# EAGLE schematic Receiver (EAGLE 5.00)
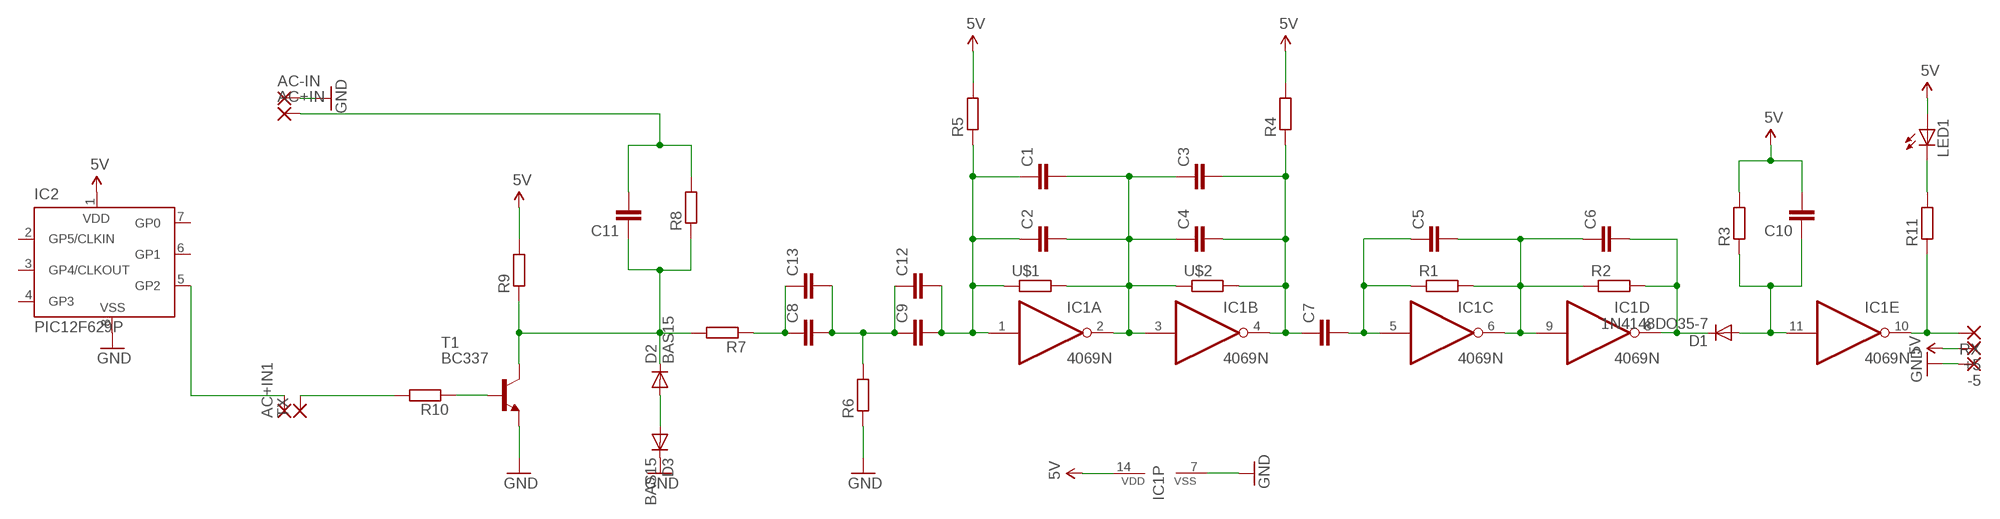
[diagram p0: schematic, sheet 1]

## Parts
+5  2,15/1,0  [2,15/1,0]
-5  2,15/1,0  [2,15/1,0]
AC+IN  2,15/1,0  [2,15/1,0]
AC+IN1  2,15/1,0  [2,15/1,0]
AC-IN  2,15/1,0  [2,15/1,0]
C1  C2.5/2  [C2.5-2]
C2  C2.5/2  [C2.5-2]
C3  C2.5/2  [C2.5-2]
C4  C2.5/2  [C2.5-2]
C5  C2.5/2  [C2.5-2]
C6  C5/2.5  [C5B2.5]
C7  C2.5/2  [C2.5-2]
C8  C5/3  [C5B3]
C9  C5/3  [C5B3]
C10  C2.5/2  [C2.5-2]
C11  C10/5  [C10B5]
C12  C5/3  [C5B3]
C13  C5/3  [C5B3]
D1  1N4148DO35-7  [DO35-7]
D2  BAS15  [DO34-7]
D3  BAS15  [DO34-7]
IC1  4069N  [DIL14]
IC2  PIC12F629P  [DIL8]
LED1  LED5MM  [LED5MM]
R1  R-EU_0207/2V  [0207/2V]
R2  R-EU_0204/5  [0204/5]
R3  R-EU_0207/2V  [0207/2V]
R4  R-EU_0207/2V  [0207/2V]
R5  R-EU_0204/7  [0204/7]
R6  R-EU_0207/2V  [0207/2V]
R7  R-EU_0207/2V  [0207/2V]
R8  R-EU_0204/7  [0204/7]
R9  R-EU_0204/7  [0204/7]
R10  R-EU_0204/7  [0204/7]
R11  R-EU_0204/7  [0204/7]
RX  2,15/1,0  [2,15/1,0]
T1  BC337  [TO92]
TX  2,15/1,0  [2,15/1,0]
U$1  R-EU_0204/5  [0204/5]
U$2  R-EU_0207/2V  [0207/2V]

## Nets
5V: +5.1(P) C10.2 IC1.14(P:VDD) IC2.1(VDD) LED1.A R3.2 R4.2 R5.2 R9.2
GND: -5.1(P) AC-IN.1(P) D3.C IC1.7(P:VSS) IC2.8(VSS) R6.1 T1.1(E)
N$1: C5.2 C6.1 IC1.6(C:O) IC1.9(D:I) R1.2 R2.1
N$2: C1.2 C2.2 C3.1 C4.1 IC1.2(A:O) IC1.3(B:I) U$1.2 U$2.1
N$3: C3.2 C4.2 C7.1 IC1.4(B:O) R4.1 U$2.2
N$4: C1.1 C2.1 C9.2 C12.2 IC1.1(A:I) R5.1 U$1.1
N$5: C5.1 C7.2 IC1.5(C:I) R1.1
N$6: C8.2 C9.1 C12.1 C13.2 R6.2
N$7: C6.2 D1.C IC1.8(D:O) R2.2
N$8: C10.1 D1.A IC1.11(E:I) R3.1
N$9: C8.1 C13.1 R7.1
N$10: R10.1 T1.2(B)
N$11: D2.A D3.A
N$12: AC+IN.1(P) C11.2 R8.2
N$13: IC1.10(E:O) R11.1 RX.1(P)
N$14: C11.1 D2.C R7.2 R8.1 R9.1 T1.3(C)
N$15: AC+IN1.1(P) IC2.5(GP2)
N$16: LED1.K(C) R11.2
N$17: R10.2 TX.1(P)
Unconnected: IC1.12(F:O) IC1.13(F:I) IC2.2(GP5/CLKIN) IC2.3(GP4/CLKOUT) IC2.4(GP3) IC2.6(GP1) IC2.7(GP0)

## Library data of the parts
+5 -5 AC+IN AC+IN1 AC-IN RX TX = wirepad:2,15/1,0: THROUGH-HOLE PAD
C1-C13 = capacitor-wima:C: CAPACITOR naming: grid - package width
D1 = diode:1N4148: DIODE high speed (Philips)
D2 D3 = diode:BAS15: DIODE high speed
IC1 = 40xx:4069: Hex INVERTER
IC2 = microchip:PIC12F6*: Data Sheet 8-Pin FLASH-Based 8-Bit CMOS Microcontrollers Source: http://www.microchip.com .. 41190c.pdf
LED1 = SparkFun:LED: LEDs Standard schematic elements and footprints for 5mm, 3mm, 1206, and 0603 sized LEDs. 5mm - Spark Fun Electronics SKU : COM-00529 (and others)
R1 R3-R7 U$1 U$2 = resistor:R-EU_: RESISTOR, European symbol
R2 R8-R11 = rcl:R-EU_: RESISTOR, European symbol
T1 = transistor:BC337: NPN TRANSISTOR